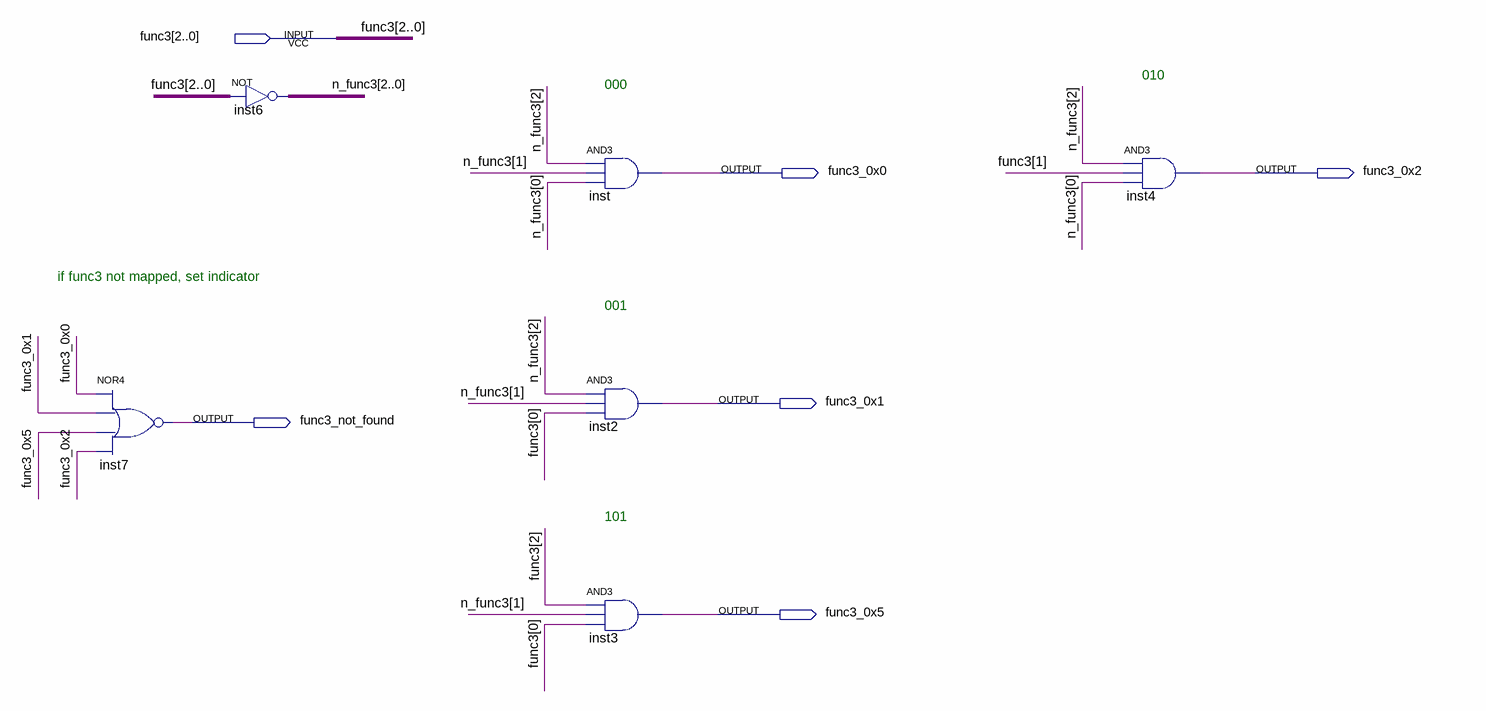
[diagram p0: schematic sheet]
// Quartus schematic func3_decoder.bdf as structural Verilog: 6 symbols, 6 pins
module func3_decoder (
  input  [2:0] func3,
  output func3_0x0,
  output func3_0x2,
  output func3_0x1,
  output func3_not_found,
  output func3_0x5
);

  wire [2:0] n_func3;

  nor inst7 (func3_not_found, func3_0x0, func3_0x1, func3_0x5, func3_0x2);
  assign n_func3 = ~func3;  // NOT inst6, 3 bits wide
  and inst (func3_0x0, n_func3[2], n_func3[1], n_func3[0]);
  and inst2 (func3_0x1, n_func3[2], n_func3[1], func3[0]);
  and inst3 (func3_0x5, func3[2], n_func3[1], func3[0]);
  and inst4 (func3_0x2, n_func3[2], func3[1], n_func3[0]);

  // Notes on the sheet:
  //   010
  //   000
  //   if func3 not mapped, set indicator
  //   001
  //   101
endmodule
